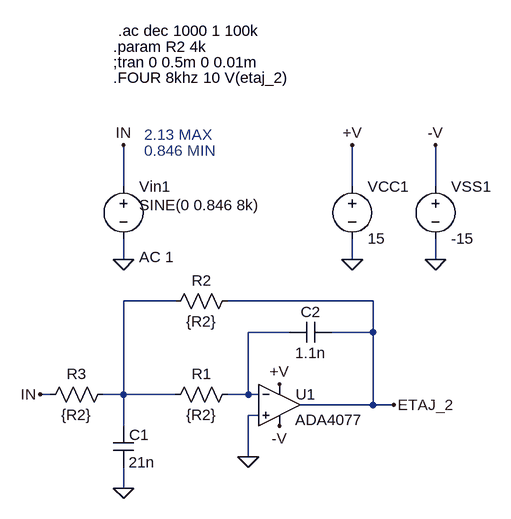
[diagram p0: schematic Liniaritate_ET2.asc]
Liniaritate_ET2.asc, the LTspice schematic file:
Version 4
SHEET 1 880 680
WIRE -128 96 -128 32
WIRE 224 96 224 32
WIRE 352 96 352 32
WIRE -128 208 -128 176
WIRE 224 208 224 176
WIRE 352 208 352 176
WIRE -48 272 -128 272
WIRE 256 272 32 272
WIRE 128 320 64 320
WIRE 256 320 256 272
WIRE 256 320 192 320
WIRE -240 416 -256 416
WIRE -128 416 -128 272
WIRE -128 416 -160 416
WIRE -48 416 -128 416
WIRE 64 416 64 320
WIRE 64 416 32 416
WIRE 80 416 64 416
WIRE 256 432 256 320
WIRE 256 432 144 432
WIRE 288 432 256 432
WIRE 80 448 64 448
WIRE -128 464 -128 416
WIRE 64 512 64 448
WIRE -128 560 -128 528
FLAG -128 208 0
FLAG -128 32 IN
FLAG 224 208 0
FLAG 352 208 0
FLAG 224 32 +V
FLAG 352 32 -V
FLAG 112 400 +V
FLAG 112 464 -V
FLAG 288 432 ETAJ_2
FLAG -128 560 0
FLAG 64 512 0
FLAG -256 416 IN
DATAFLAG 256 384 ""
DATAFLAG 288 432 ""
SYMBOL voltage -128 80 R0
WINDOW 123 24 124 Left 2
WINDOW 39 0 0 Left 2
WINDOW 3 24 44 Left 2
SYMATTR Value2 AC 1
SYMATTR Value SINE(0 0.846 8k)
SYMATTR InstName Vin1
SYMBOL voltage 224 80 R0
WINDOW 123 0 0 Left 2
WINDOW 39 0 0 Left 2
SYMATTR InstName VCC1
SYMATTR Value 15
SYMBOL voltage 352 80 R0
WINDOW 123 0 0 Left 2
WINDOW 39 0 0 Left 2
SYMATTR InstName VSS1
SYMATTR Value -15
SYMBOL res 48 400 R90
WINDOW 0 0 56 VBottom 2
WINDOW 3 32 56 VTop 2
SYMATTR InstName R1
SYMATTR Value {R2}
SYMBOL cap -144 464 R0
WINDOW 0 25 14 Left 2
SYMATTR InstName C1
SYMATTR Value 21n
SYMBOL cap 192 304 R90
WINDOW 0 0 32 VBottom 2
WINDOW 3 32 32 VTop 2
SYMATTR InstName C2
SYMATTR Value 1.1n
SYMBOL OpAmps\\ADA4077 112 368 R0
WINDOW 0 25 48 Left 2
WINDOW 3 24 87 Left 2
SYMATTR InstName U1
SYMBOL res 48 256 R90
WINDOW 0 0 56 VBottom 2
WINDOW 3 32 56 VTop 2
SYMATTR InstName R2
SYMATTR Value {R2}
SYMBOL res -144 400 R90
WINDOW 0 0 56 VBottom 2
WINDOW 3 32 56 VTop 2
SYMATTR InstName R3
SYMATTR Value {R2}
TEXT -144 -96 Left 2 !;tran 0 0.5m 0 0.01m
TEXT -144 -120 Left 2 !.param R2 4k
TEXT -144 -72 Left 2 !.FOUR 8khz 10 V(etaj_2)
TEXT -96 16 Left 2 ;2.13 MAX
TEXT -96 40 Left 2 ;0.846 MIN
TEXT -136 -144 Left 2 !.ac dec 1000 1 100k

The netlist it stands for:
* Liniaritate_ET2.asc
Vin1 IN 0 SINE(0 0.846 8k) AC 1
VCC1 +V 0 15
VSS1 -V 0 -15
R1 N002 N001 {R2}
C1 N001 0 21n
C2 ETAJ_2 N002 1.1n
XU1 0 N002 +V -V ETAJ_2 ADA4077  ; pins In+ In- V+ V- OUT
R2 ETAJ_2 N001 {R2}
R3 N001 IN {R2}
;tran 0 0.5m 0 0.01m
.param R2 4k
.FOUR 8khz 10 V(etaj_2)
* 2.13 MAX
* 0.846 MIN
.ac dec 1000 1 100k
.backanno
.end